# Altium schematic sheet controlled_buck_boost_converter_ch1.SchDoc: Controlled Buck-Boost Converter CH1
size A4; Date: 2016-01-06; Author: Piotr Kuligowski; Revision: 1-0; SheetTotal: 14; Model: EM1
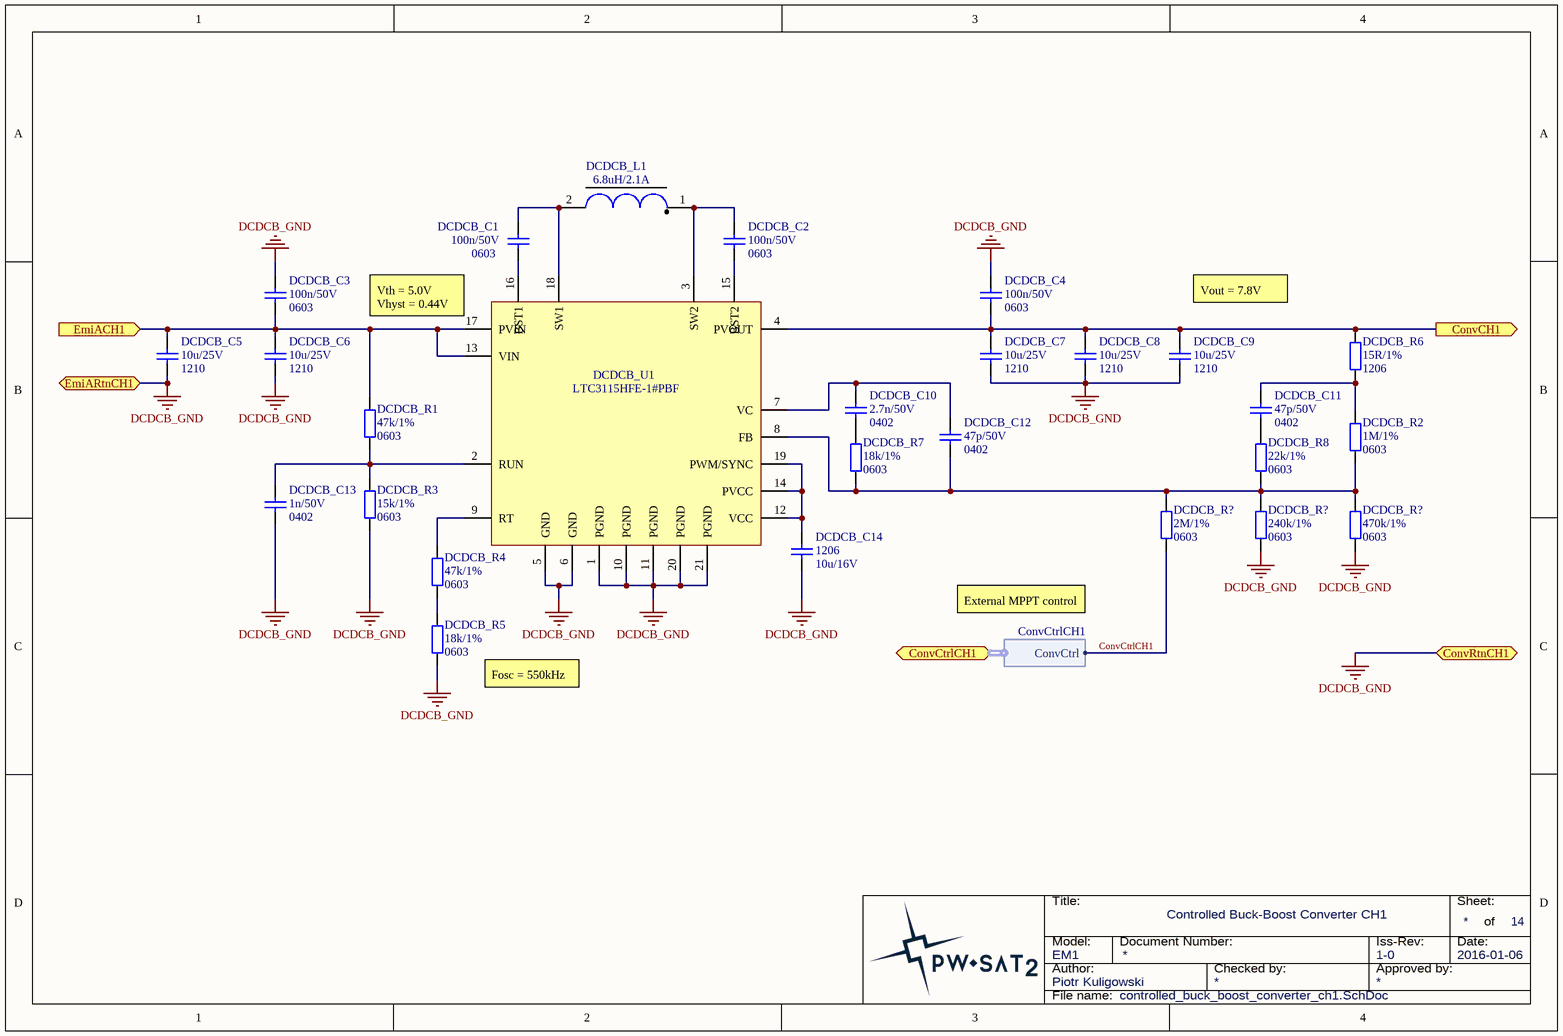
[diagram p0: controlled_buck_boost_converter_ch1.SchDoc]

## Parts
(Parts that share a designator on the sheet are numbered #1, #2 ... from top to bottom, then left to right.)
DCDCB_C1  Package: 0603  [SMD_Capacitor_0603]  (hidden comment: 100n/50V)
DCDCB_C2  Package: 0603  [SMD_Capacitor_0603]  (hidden comment: 100n/50V)
DCDCB_C3  Package: 0603  [SMD_Capacitor_0603]  (hidden comment: 100n/50V)
DCDCB_C4  Package: 0603  [SMD_Capacitor_0603]  (hidden comment: 100n/50V)
DCDCB_C5  Package: 1210  [SMD_Capacitor_1210]  (hidden comment: 10u/25V)
DCDCB_C6  Package: 1210  [SMD_Capacitor_1210]  (hidden comment: 10u/25V)
DCDCB_C7  Package: 1210  [SMD_Capacitor_1210]  (hidden comment: 10u/25V)
DCDCB_C8  Package: 1210  [SMD_Capacitor_1210]  (hidden comment: 10u/25V)
DCDCB_C9  Package: 1210  [SMD_Capacitor_1210]  (hidden comment: 10u/25V)
DCDCB_C10  Package: 0402  [SMD_Capacitor_0402]  (hidden comment: 2.7n/50V)
DCDCB_C11  Package: 0402  [SMD_Capacitor_0402]  (hidden comment: 47p/50V)
DCDCB_C12  Package: 0402  [SMD_Capacitor_0402]  (hidden comment: 47p/50V)
DCDCB_C13  Package: 0402  [SMD_Capacitor_0402]  (hidden comment: 1n/50V)
DCDCB_C14  Packge: 1206  [SMD_Capacitor_1206]  (hidden comment: 10u/16V)
DCDCB_L1  6.8uH/2.1A  [Coilcraft_MSS6132]
DCDCB_R1  Package: 0603  [SMD_Resistor_0603]  (hidden comment: 47k/1%)
DCDCB_R2  Package: 0603  [SMD_Resistor_0603]  (hidden comment: 1M/1%)
DCDCB_R3  Package: 0603  [SMD_Resistor_0603]  (hidden comment: 15k/1%)
DCDCB_R4  Package: 0603  [SMD_Resistor_0603]  (hidden comment: 47k/1%)
DCDCB_R5  Package: 0603  [SMD_Resistor_0603]  (hidden comment: 18k/1%)
DCDCB_R6  Package: 1206  [SMD_Resistor_1206]  (hidden comment: 15R/1%)
DCDCB_R7  Package: 0603  [SMD_Resistor_0603]  (hidden comment: 18k/1%)
DCDCB_R8  Package: 0603  [SMD_Resistor_0603]  (hidden comment: 22k/1%)
DCDCB_R?#1  Package: 0603  [SMD_Resistor_0603]  (hidden comment: 2M/1%)
DCDCB_R?#2  Package: 0603  [SMD_Resistor_0603]  (hidden comment: 240k/1%)
DCDCB_R?#3  Package: 0603  [SMD_Resistor_0603]  (hidden comment: 470k/1%)
DCDCB_U1  LTC3115HFE-1#PBF  [LT-FE-20-EPV-CA_N]

## Ports
ConvCH1 (out), ConvCtrlCH1 (harness ConvCtrlCH1), ConvRtnCH1, EmiACH1 (in), EmiARtnCH1

## Harnesses
ConvCtrlCH1: ConvCtrl

## Nets
DCDCB_GND: DCDCB_C3.1 DCDCB_C4.1 DCDCB_C5.2 DCDCB_C6.2 DCDCB_C7.2 DCDCB_C8.2 DCDCB_C9.2 DCDCB_C13.2 DCDCB_C14.2 DCDCB_R3.2 DCDCB_R5.2 DCDCB_R?#2.2 DCDCB_R?#3.2 DCDCB_U1.1(PGND) DCDCB_U1.5(GND) DCDCB_U1.6(GND) DCDCB_U1.10(PGND) DCDCB_U1.11(PGND) DCDCB_U1.20(PGND) DCDCB_U1.21(PGND) ; port EmiARtnCH1, port ConvRtnCH1
ConvCH1: DCDCB_C4.2 DCDCB_C7.1 DCDCB_C8.1 DCDCB_C9.1 DCDCB_R6.1 DCDCB_U1.4(PVOUT) ; port ConvCH1
ConvCtrlCH1: DCDCB_R?#1.1 ; port ConvCtrlCH1.ConvCtrl
EmiACH1: DCDCB_C3.2 DCDCB_C5.1 DCDCB_C6.1 DCDCB_R1.1 DCDCB_U1.13(VIN) DCDCB_U1.17(PVIN) ; port EmiACH1
NetDCDCB_C1_1: DCDCB_C1.1 DCDCB_L1.2 DCDCB_U1.18(SW1)
NetDCDCB_C1_2: DCDCB_C1.2 DCDCB_U1.16(BST1)
NetDCDCB_C2_1: DCDCB_C2.1 DCDCB_L1.1 DCDCB_U1.3(SW2)
NetDCDCB_C2_2: DCDCB_C2.2 DCDCB_U1.15(BST2)
NetDCDCB_C10_1: DCDCB_C10.1 DCDCB_C12.1 DCDCB_U1.7(VC)
NetDCDCB_C10_2: DCDCB_C10.2 DCDCB_R7.1
NetDCDCB_C11_1: DCDCB_C11.1 DCDCB_R2.1 DCDCB_R6.2
NetDCDCB_C11_2: DCDCB_C11.2 DCDCB_R8.1
NetDCDCB_C12_2: DCDCB_C12.2 DCDCB_R2.2 DCDCB_R7.2 DCDCB_R8.2 DCDCB_R?#1.2 DCDCB_R?#2.1 DCDCB_R?#3.1 DCDCB_U1.8(FB)
NetDCDCB_C13_1: DCDCB_C13.1 DCDCB_R1.2 DCDCB_R3.1 DCDCB_U1.2(RUN)
NetDCDCB_C14_1: DCDCB_C14.1 DCDCB_U1.12(VCC) DCDCB_U1.14(PVCC) DCDCB_U1.19(PWM/SYNC)
NetDCDCB_R4_1: DCDCB_R4.1 DCDCB_U1.9(RT)
NetDCDCB_R4_2: DCDCB_R4.2 DCDCB_R5.1

## Notes on the sheet
- (near DCDCB_U1) Vth = 5.0V
  Vhyst = 0.44V
- (near DCDCB_C9) Vout = 7.8V
- External MPPT control
- (near DCDCB_R5) Fosc = 550kHz
- Title:
- Sheet:
- of
- Author:
- Model:
- Document Number:
- Checked by:
- Iss-Rev:
- Approved by:
- Date:
- File name:

## Library data of the parts
DCDCB_C1-DCDCB_C4 = Cer_C0603T104K5RALTU: Ceramic Cap Kemet COTS 100n/50V X7R 0603; Manufacturer: Kemet; ManufacturerPartNumber: C0603T104K5RALTU; Value: 100n/50V
DCDCB_C5-DCDCB_C9 = Cer_GCJ32ER71E106KA12L: Ceramic Cap Murata Automotive 10u/25V X7R 1210; Manufacturer: Murata; ManufacturerPartNumber: GCJ32ER71E106KA12L; Value: 10u/25V
DCDCB_C10 = Cer_GCM2165C1H272JA16D: Ceramic Cap Murata Automotive 2.7n/50V C0G 0402; Manufacturer: Murata; ManufacturerPartNumber: GCM2165C1H272JA16D; Value: 2.7n/50V
DCDCB_C11 DCDCB_C12 = Cer_GCM1555C1H470JA16D: Ceramic Cap Murata Automotive 47p/50V C0G 0402; Manufacturer: Murata; ManufacturerPartNumber: GCM1555C1H470JA16D; Value: 47p/50V
DCDCB_C13 = Cer_GCM155R71H102KA37D: Ceramic Cap Murata Automotive 1n/50V X7R 0402; Manufacturer: Murata; ManufacturerPartNumber: GCM155R71H102KA37D; Value: 1n/50V
DCDCB_C14 = Cer_C1206T106K4RACTU: Ceramic Cap Kemet COTS 10u/16V X7R 1206; ManufacturerPartNumber: C1206T106K4RACTU; Manufacturer: Kemet; Value: 10u/16V
DCDCB_L1 = MSS6132-682MLx: Coilcraft MSS6132 Inductor, L=6.8uH, Irise20deg=2.1A, ESR=52mR, SRF=47MHz.; Manufacturer: Coilcraft; ManufacturerPartNumber: MSS6132-682MLx; Value: 6.8uH/2.1A
DCDCB_R1 DCDCB_R4 = CRCW060347K0FKxxxx: 47k/1% Vishay CRCW 0603 Resistor. 100mW, 100ppm, 75V.; Manufacturer: Vishay; ManufacturerPartNumber: CRCW060347K0FKxxxx; Value: 47k/1%
DCDCB_R2 = CRCW06031M00FKxxxx: 1M/1% Vishay CRCW 0603 Resistor. 100mW, 200ppm, 75V.; ManufacturerPartNumber: CRCW06031M00FKxxxx; Manufacturer: Vishay; Value: 1M/1%
DCDCB_R3 = CRCW060315K0FKxxxx: 15k/1% Vishay CRCW 0603 Resistor. 100mW, 200ppm, 75V.; ManufacturerPartNumber: CRCW060315K0FKxxxx; Manufacturer: Vishay; Value: 15k/1%
DCDCB_R5 DCDCB_R7 = CRCW060318K0FKxxxx: 18k/1% Vishay CRCW 0603 Resistor. 100mW, 200ppm, 75V.; ManufacturerPartNumber: CRCW060318K0FKxxxx; Manufacturer: Vishay; Value: 18k/1%
DCDCB_R6 = CRCW120615R0FKxxxx: 15R/1% Vishay CRCW 1206 Resistor. 250mW, 100ppm, 200V.; ManufacturerPartNumber: CRCW120615R0FKxxxx; Manufacturer: Vishay; Value: 15R/1%
DCDCB_R8 = CRCW060322K0FKxxxx: 22k/1% Vishay CRCW 0603 Resistor. 100mW, 200ppm, 75V.; ManufacturerPartNumber: CRCW060322K0FKxxxx; Manufacturer: Vishay; Value: 22k/1%
DCDCB_R?#1 = CRCW06032M00FKxxxx: 2M/1% Vishay CRCW 0603 Resistor. 100mW, 200ppm, 75V.; ManufacturerPartNumber: CRCW06032M00FKxxxx; Manufacturer: Vishay; Value: 2M/1%
DCDCB_R?#2 = CRCW0603240KFKxxxx: 240k/1% Vishay CRCW 0603 Resistor. 100mW, 200ppm, 75V.; Manufacturer: Vishay; ManufacturerPartNumber: CRCW0603240KFKxxxx; Value: 240k/1%
DCDCB_R?#3 = CRCW0603470KFKxxxx: 470k/1% Vishay CRCW 0603 Resistor. 100mW, 100ppm, 75V.; Manufacturer: Vishay; ManufacturerPartNumber: CRCW0603470KFKxxxx; Value: 470k/1%
DCDCB_U1 = LTC3115HFE-1#PBF: 40V, 2A Synchronous Buck-Boost DC/DC Converter, 20-pin SOP (FE-20-EPV-CA), -40 to 150 degC, Pb-Free; Manufacturer: Linear Technology; Package: FE-20-EPV-CA; Value: LTC3115HFE-1#PBF